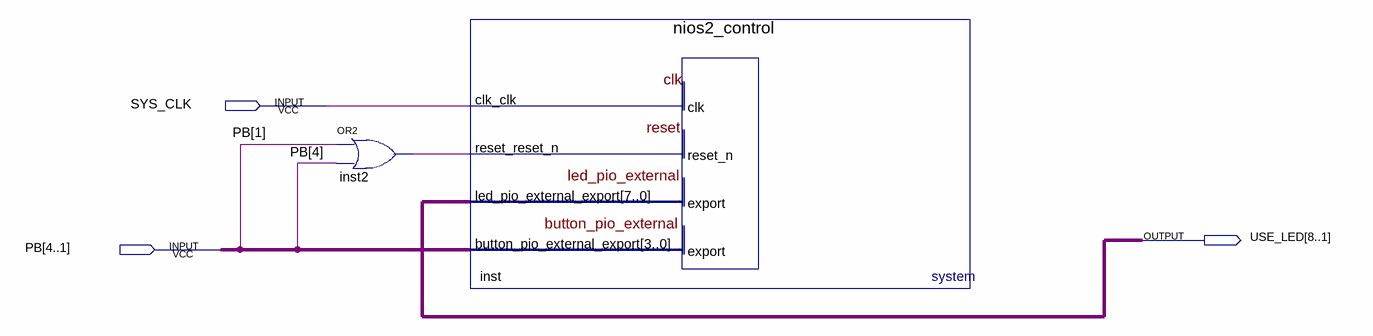
[diagram p0: schematic sheet]
// Quartus schematic BeMicro_MAX10_top.bdf as structural Verilog: 2 symbols, 3 pins
module BeMicro_MAX10_top (
  input  SYS_CLK,
  input  [4:1] PB,
  output [8:1] USE_LED
);

  wire inst2_out;

  or inst2 (inst2_out, PB[1], PB[4]);
  nios2_control inst (
    .clk_clk(SYS_CLK), .reset_reset_n(inst2_out), .button_pio_external_export(PB),
    .led_pio_external_export(USE_LED));
endmodule
